# EAGLE schematic ESP32_zigbee_zwave1 (EAGLE 9.6.2)
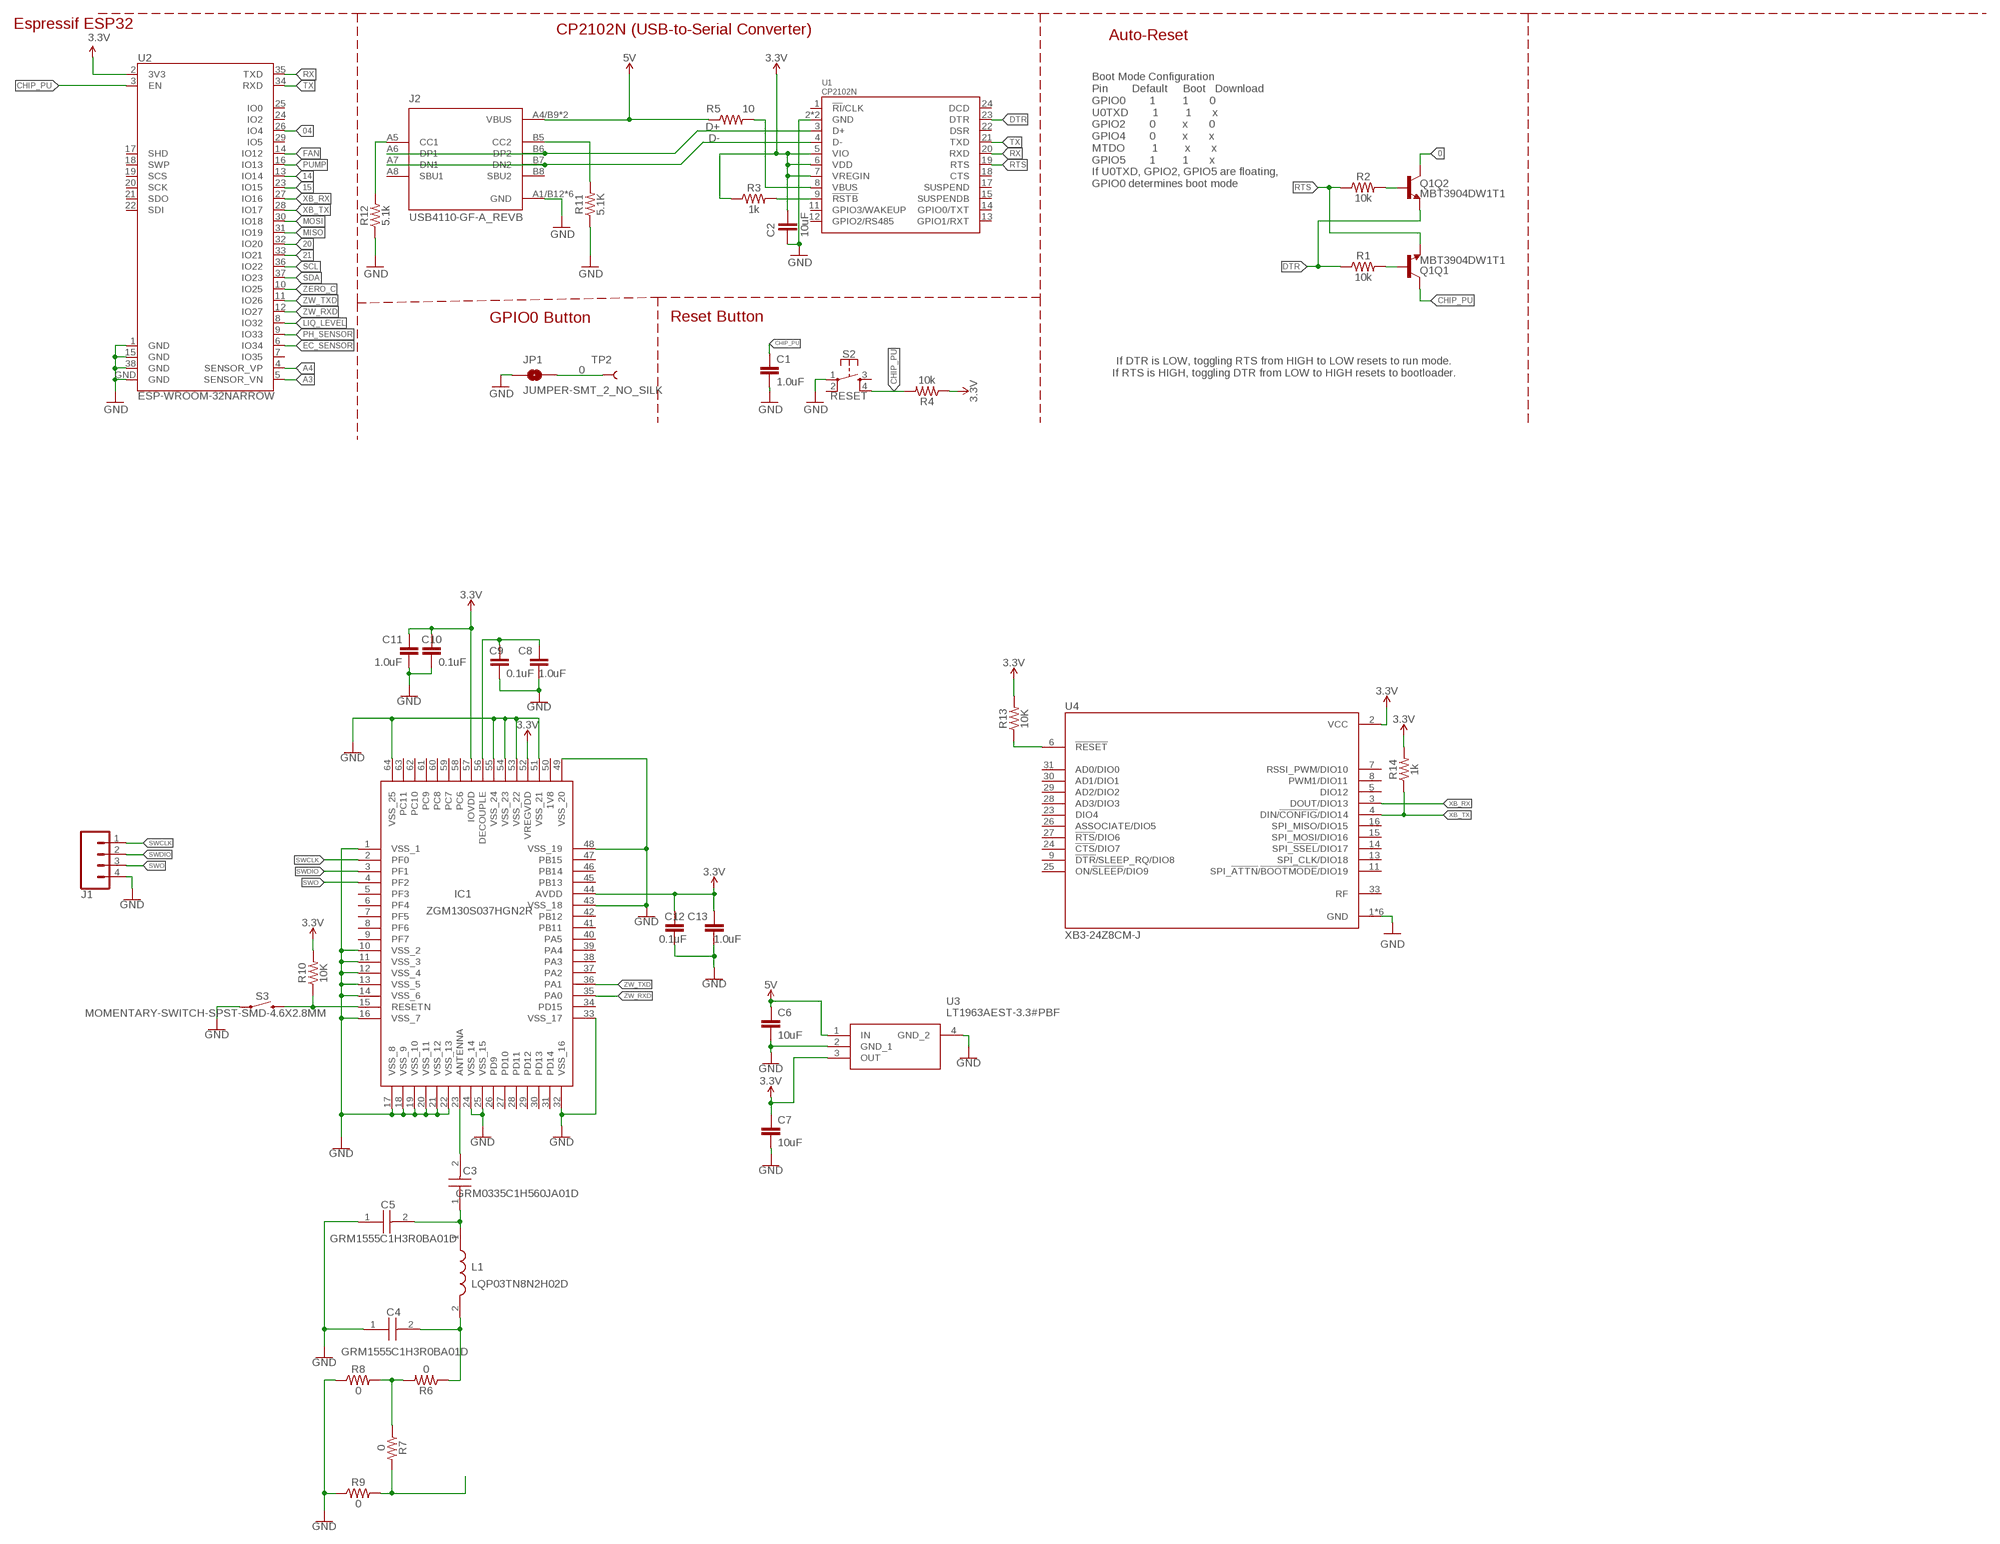
[diagram p0: schematic, sheet 1]

## Parts
C1  1.0uF  1.0UF-0402T-16V-10%  [0402-TIGHT]
C2  10uF  10UF-0402T-6.3V-20%  [0402-TIGHT]
C3  GRM0335C1H560JA01D  [CAPC0603X33N]
C4  GRM1555C1H3R0BA01D  [CAPC1005X55N]
C5  GRM1555C1H3R0BA01D  [CAPC1005X55N]
C6  10uF  10UF-0402T-6.3V-20%  [0402-TIGHT]
C7  10uF  10UF-0402T-6.3V-20%  [0402-TIGHT]
C8  1.0uF  1.0UF-0402T-16V-10%  [0402-TIGHT]
C9  0.1uF  0.1UF-0402T-6.3V-10%-X7R  [0402-TIGHT]
C10  0.1uF  0.1UF-0402T-6.3V-10%-X7R  [0402-TIGHT]
C11  1.0uF  1.0UF-0402T-16V-10%  [0402-TIGHT]
C12  0.1uF  0.1UF-0402T-6.3V-10%-X7R  [0402-TIGHT]
C13  1.0uF  1.0UF-0402T-16V-10%  [0402-TIGHT]
IC1  ZGM130S037HGN2R  [ZGM130S037HGN2R]
J1  CONN_041X04_NO_SILK  [1X04_NO_SILK]
J2  USB4110-GF-A_REVB  [GCT_USB4110-GF-A_REVB]
JP1  JUMPER-SMT_2_NO_SILK  [SMT-JUMPER_2_NO_SILK]
L1  LQP03TN8N2H02D  [LQP03TG3N1B02D]
Q1  MBT3904DW1T1  TRANS_NPN_DUAL-MBT3904DW1T1  [SC70-6]
R1  10k  10KOHM-0402T-1/16W-1%  [0402-TIGHT]
R2  10k  10KOHM-0402T-1/16W-1%  [0402-TIGHT]
R3  1k  1KOHM-0402T-1/16W-1%  [0402-TIGHT]
R4  10k  10KOHM-0402T-1/16W-1%  [0402-TIGHT]
R5  10  10OHM-0603-1/10W-1%  [0603]
R6  0  0OHM-0402T-1/10W  [0402-TIGHT]
R7  0  0OHM-0402T-1/10W  [0402-TIGHT]
R8  0  0OHM-0402T-1/10W  [0402-TIGHT]
R9  0  0OHM-0402T-1/10W  [0402-TIGHT]
R10  10K  10KOHM-0402-1/10W-0.1%  [0402-TIGHT]
R11  5.1K  RESISTOR0402T  [0402-TIGHT]
R12  5.1k  RESISTOR0402T  [0402-TIGHT]
R13  10K  10KOHM-0402-1/10W-0.1%  [0402-TIGHT]
R14  1k  1KOHM-0402T-1/16W-1%  [0402-TIGHT]
S2  RESET  MOMENTARY-SWITCH-SPST-2-SMD-4.6X2.8MM  [TACTILE_SWITCH_SMD_4.6X2.8MM]
S3  MOMENTARY-SWITCH-SPST-SMD-4.6X2.8MM  [TACTILE_SWITCH_SMD_4.6X2.8MM]
TP2  TEST-POINTTP_15TH_THRU  [TP_15TH]
U1  CP2102N  [QFN24]
U2  ESP-WROOM-32NARROW  [ESP-WROOM-32-NARROW]
U3  LT1963AEST-3.3#PBF  [SOT230P700X180-4N]
U4  XB3-24Z8CM-J  [XCVR_XB3-24Z8CM-J]

## Nets
0: JP1.2 Q1.6(Q2:C) TP2.P$1
3.3V: C2.1 C7.1 C10.1 C11.2 C12.1 C13.2 IC1.44(AVDD) IC1.52(VREGVDD) IC1.57(IOVDD) R3.1 R4.1 R10.2 R13.2 R14.2 U1.5(VIO) U1.6(VDD) U1.7(VREGIN) U2.2(3V3) U3.3(OUT) U4.2(VCC)
04: U2.26(IO4)
5V: C6.1 J2.A4/B9(VBUS) J2.B4/A9(VBUS) R5.1 U3.1(IN)
14: U2.13(IO14)
15: U2.23(IO15)
20: U2.32(IO20)
21: U2.33(IO21)
A3: U2.5(SENSOR_VN)
A4: U2.4(SENSOR_VP)
CHIP_PU: C1.1 Q1.3(Q1:C) R4.2 S2.4 U2.3(EN)
D+: J2.A6(DP1) J2.B6(DP2) U1.3(D+)
D-: J2.A7(DN1) J2.B7(DN2) U1.4(D-)
DTR: Q1.1(Q2:E) R1.1 U1.23(DTR)
EC_SENSOR: U2.6(IO34)
FAN: U2.14(IO12)
GND: C1.2 C2.2 C4.1 C5.1 C6.2 C7.2 C8.1 C9.2 C10.2 C11.1 C12.2 C13.1 IC1.1(VSS_1) IC1.10(VSS_2) IC1.11(VSS_3) IC1.12(VSS_4) IC1.13(VSS_5) IC1.14(VSS_6) IC1.16(VSS_7) IC1.17(VSS_8) IC1.18(VSS_9) IC1.19(VSS_10) IC1.20(VSS_11) IC1.21(VSS_12) IC1.22(VSS_13) IC1.24(VSS_14) IC1.25(VSS_15) IC1.32(VSS_16) IC1.33(VSS_17) IC1.43(VSS_18) IC1.48(VSS_19) IC1.49(VSS_20) IC1.51(VSS_21) IC1.53(VSS_22) IC1.54(VSS_23) IC1.55(VSS_24) IC1.64(VSS_25) J1.4 J2.A1/B12(GND) J2.B1/A12(GND) J2.S1(GND) J2.S2(GND) J2.S3(GND) J2.S4(GND) JP1.1 R8.1 R9.1 R11.1 R12.1 S2.1 S3.1 S3.2 U1.2(GND) U1.PAD(GND) U2.1(GND) U2.15(GND) U2.38(GND) U2.GND U3.2(GND_1) U3.4(GND_2) U4.1(GND) U4.10(GND) U4.12(GND) U4.21(GND) U4.32(GND) U4.34(GND)
LIQ_LEVEL: U2.8(IO32)
MISO: U2.31(IO19)
MOSI: U2.30(IO18)
N$1: Q1.5(Q1:B) R1.2
N$2: Q1.2(Q2:B) R2.2
N$3: R3.2 U1.9(!RSTB)
N$4: R5.2 U1.8(VBUS)
N$5: C3.2 IC1.23(ANTENNA)
N$6: C3.1 C5.2 L1.1
N$7: C4.2 L1.2 R6.1
N$8: R6.2 R7.1 R8.2
N$9: R7.2 R9.2
N$10: IC1.15(RESETN) R10.1 S3.3 S3.4
N$11: J2.B5(CC2) R11.2
N$12: J2.A5(CC1) R12.2
N$13: R13.1 U4.6(!RESET)
N$14: C8.2 C9.1 IC1.56(DECOUPLE)
PH_SENSOR: U2.9(IO33)
PUMP: U2.16(IO13)
RTS: Q1.4(Q1:E) R2.1 U1.19(RTS)
RX: U1.20(RXD) U2.35(TXD)
SCL: U2.36(IO22)
SDA: U2.37(IO23)
SWCLK: IC1.2(PF0) J1.1
SWDIO: IC1.3(PF1) J1.2
SWO: IC1.4(PF2) J1.3
TX: U1.21(TXD) U2.34(RXD)
XB_RX: U2.27(IO16) U4.3(DOUT/DIO13)
XB_TX: R14.1 U2.28(IO17) U4.4(DIN/!CONFIG!/DIO14)
ZERO_C: U2.10(IO25)
ZW_RXD: IC1.35(PA0) U2.12(IO27)
ZW_TXD: IC1.36(PA1) U2.11(IO26)
Unconnected: IC1.5(PF3) IC1.6(PF4) IC1.7(PF5) IC1.8(PF6) IC1.9(PF7) IC1.26(PD9) IC1.27(PD10) IC1.28(PD11) IC1.29(PD12) IC1.30(PD13) IC1.31(PD14) IC1.34(PD15) IC1.37(PA2) IC1.38(PA3) IC1.39(PA4) IC1.40(PA5) IC1.41(PB11) IC1.42(PB12) IC1.45(PB13) IC1.46(PB14) IC1.47(PB15) IC1.50(1V8) IC1.58(PC6) IC1.59(PC7) IC1.60(PC8) IC1.61(PC9) IC1.62(PC10) IC1.63(PC11) J2.A8(SBU1) J2.B8(SBU2) S2.2 S2.3 U1.1(!RI!/CLK) U1.11(GPIO3/WAKEUP) U1.12(GPIO2/RS485) U1.13(GPIO1/RXT) U1.14(GPIO0/TXT) U1.15(SUSPENDB) U1.17(SUSPEND) U1.18(CTS) U1.22(DSR) U1.24(DCD) U2.7(IO35) U2.17(SHD) U2.18(SWP) U2.19(SCS) U2.20(SCK) U2.21(SDO) U2.22(SDI) U2.24(IO2) U2.25(IO0) U2.29(IO5) U4.5(DIO12) U4.7(RSSI_PWM/DIO10) U4.8(PWM1/DIO11) U4.9(!DTR!/SLEEP_RQ/DIO8) U4.11(SPI_!ATTN!/!BOOTMODE!/DIO19) U4.13(SPI_CLK/DIO18) U4.14(SPI_!SSEL!/DIO17) U4.15(SPI_MOSI/DIO16) U4.16(SPI_MISO/DIO15) U4.23(DIO4) U4.24(!CTS!/DIO7) U4.25(ON/!SLEEP!/DIO9) U4.26(ASSOCIATE/DIO5) U4.27(!RTS!/DIO6) U4.28(AD3/DIO3) U4.29(AD2/DIO2) U4.30(AD1/DIO1) U4.31(AD0/DIO0) U4.33(RF)

## Notes on the sheet
- Espressif ESP32
- CP2102N (USB-to-Serial Converter)
- Auto-Reset
- Boot Mode Configuration
  Pin        Default     Boot   Download
  GPIO0        1         1       0
  U0TXD        1         1       x
  GPIO2        0         x       0
  GPIO4        0         x       x
  MTDO         1         x       x
  GPIO5        1         1       x
  If U0TXD, GPIO2, GPIO5 are floating, 
  GPIO0 determines boot mode
- GPIO0 Button | Reset Button
- If DTR is LOW, toggling RTS from HIGH to LOW resets to run mode.
  If RTS is HIGH, toggling DTR from LOW to HIGH resets to bootloader.

## Library data of the parts
C1 C8 C11 C13 = SparkFun-Capacitors:1.0UF: 1µF ceramic capacitors A capacitor is a passive two-terminal electrical component used to store electrical energy temporarily in an electric field.; PROD_ID: CAP-12417
C2 C6 C7 = SparkFun-Capacitors:10UF: 10.0µF ceramic capacitors A capacitor is a passive two-terminal electrical component used to store electrical energy temporarily in an electric field.; PROD_ID: CAP-14848
C3 = GRM0335C1H560JA01D:GRM0335C1H560JA01D: Murata 0201 GRM 56pF Ceramic Multilayer Capacitor, 50 V, +125C, C0G Dielectric, +/-5% SMD Source: Datasheet <https://psearch.en.murata.com/capacitor/product/GRM0335C1H560JA01#.html>; ARROW_PART_NUMBER: GRM0335C1H560JA01D; ARROW_PRICE-STOCK: https://www.arrow.com/en/products/grm0335c1h560ja01d/murata-manufacturing; DESCRIPTION: Murata 0201 GRM 56pF Ceramic Multilayer Capacitor, 50 V, +125C, C0G Dielectric, +/-5% SMD; HEIGHT: 0.33mm; MANUFACTURER_NAME: Murata Electronics; MANUFACTURER_PART_NUMBER: GRM0335C1H560JA01D; MOUSER_PART_NUMBER: 81-GRM0335C1H560JA1D; MOUSER_PRICE-STOCK: https://www.mouser.com/Search/Refine.aspx?Keyword=81-GRM0335C1H560JA1D
C4 C5 = GRM1555C1H3R0BA01D:GRM1555C1H3R0BA01D: Capacitor MLCC GRM 0402 3pF 50V C0G Murata 0402 GRM 3pF Ceramic Multilayer Capacitor, 50 V dc, +125C, C0G Dielectric, +/-0.1pF SMD Source: Datasheet <https://datasheet.datasheetarchive.com/originals/distributors/Datasheets_SAMA/ec4f1577dddcc7a13ddad897a28002d3.pdf>; ARROW_PART_NUMBER: GRM1555C1H3R0BA01D; ARROW_PRICE-STOCK: https://www.arrow.com/en/products/grm1555c1h3r0ba01d/murata-manufacturing?region=nac; DESCRIPTION: Capacitor MLCC GRM 0402 3pF 50V C0G Murata 0402 GRM 3pF Ceramic Multilayer Capacitor, 50 V dc, +125C, C0G Dielectric, +/-0.1pF SMD; HEIGHT: 0.55mm; MANUFACTURER_NAME: Murata Electronics; MANUFACTURER_PART_NUMBER: GRM1555C1H3R0BA01D; MOUSER_PART_NUMBER: 81-GRM1555C1H3R0BA1D; MOUSER_PRICE-STOCK: https://www.mouser.co.uk/ProductDetail/Murata-Electronics/GRM1555C1H3R0BA01D?qs=ouTquLLW2S5g5Yak4wnjeg%3D%3D
C9 C10 C12 = SparkFun-Capacitors:0.1UF: 0.1µF ceramic capacitors A capacitor is a passive two-terminal electrical component used to store electrical energy temporarily in an electric field.; PROD_ID: CAP-14993
IC1 = ZGM130S037HGN2R:ZGM130S037HGN2R: Z-Wave Module 64-Pin LGA T/R Source: Datasheet <https://www.silabs.com/documents/public/data-sheets/zgm130s-datasheet.pdf>; ARROW_PART_NUMBER: ZGM130S037HGN2R; ARROW_PRICE-STOCK: https://www.arrow.com/en/products/zgm130s037hgn2r/silicon-labs; DESCRIPTION: Z-Wave Module 64-Pin LGA T/R; HEIGHT: 1.3mm; MANUFACTURER_NAME: Silicon Labs; MANUFACTURER_PART_NUMBER: ZGM130S037HGN2R; MOUSER_PART_NUMBER: 634-ZGM130S037HGN2R; MOUSER_PRICE-STOCK: https://www.mouser.co.uk/ProductDetail/Silicon-Labs/ZGM130S037HGN2R?qs=OTrKUuiFdkYipTRfJ5tk3g%3D%3D
J1 = SparkFun-Connectors:CONN_04: Multi connection point. Often used as Generic Header-pin footprint for 0.1 inch spaced/style header connections On any of the 0.1 inch spaced packages, you can populate with these: Break Away Headers - Straight <https://www.sparkfun.com/products/116> (PRT-00116) Break Away Male Headers - Right Angle <https://www.sparkfun.com/products/553> (PRT-00553) Female Headers <https://www.sparkfun.com/products/115> (PRT-00115) Break Away Headers - Machine Pin <https://www.sparkfun.com/products/117> (PRT-00117) Break Away Female Headers - Swiss Machine Pin <https://www.sparkfun.com/products/743> (PRT-00743) For SCREWTERMINALS and SPRING TERMINALS visit here: Screw Terimnals on SparkFun.com <https://www.sparkfun.com/search/results?term=Screw+Terminals> (5mm/3.5mm/2.54mm spacing) This device is also useful as a general connection point to wire up your design to another part of your project. Our various solder wires solder well into these plated through hole pads. Hook-Up Wire - Assortment (Stranded, 22 AWG) <https://www.sparkfun.com/products/11375> (PRT-11375) Hook-Up Wire - Assortment (Solid Core, 22 AWG) <https://www.sparkfun.com/products/11367> (PRT-11367) View the entire wire category on our website here <https://www.sparkfun.com/categories/141> Special notes: Molex polarized connector foot print use with SKU : PRT-08231 with associated crimp pins and housings. 1MM SMD Version SKU: PRT-10208; PROD_ID: CONN-09696
J2 = USB4110-GF-A_REVB:USB4110-GF-A_REVB: Check availability <https://pricing.snapeda.com/parts/USB4110-GF-A/GCT/view-part?ref=eda>; AVAILABILITY: In Stock; DESCRIPTION: USB-C (USB TYPE-C) USB 2.0 Receptacle Connector 24 (16+8 Dummy) Position Surface Mount, Right Angle; Through Hole; MF: GCT; MP: USB4110-GF-A; PACKAGE: None; PRICE: None; PURCHASE-URL: https://pricing.snapeda.com/search/part/USB4110-GF-A/?ref=eda
JP1 = SparkFun-Jumpers:JUMPER-SMT_2_NO: Normally open jumper This jumper has two pads in close proximity to each other. Apply solder to close the connection. Round pads are easier to solder for beginners, but are a lot larger. SparkFun Product that uses the round pads: SparkFun EL Sequencer <https://www.sparkfun.com/products/12781>
L1 = LQP03TN8N2H02D:LQP03TN8N2H02D: Murata LQP Series Shielded Wire-wound SMD Inductor with a Non-Magnetic Core Core, 8.2 nH +/-3% 250mA Idc Q:14 Source: Datasheet <https://psearch.en.murata.com/inductor/product/LQP03TN8N2H02#.html>; ARROW_PART_NUMBER: LQP03TN8N2H02D; ARROW_PRICE-STOCK: https://www.arrow.com/en/products/lqp03tn8n2h02d/murata-manufacturing; DESCRIPTION: Murata LQP Series Shielded Wire-wound SMD Inductor with a Non-Magnetic Core Core, 8.2 nH +/-3% 250mA Idc Q:14; HEIGHT: 0.33mm; MANUFACTURER_NAME: Murata Electronics; MANUFACTURER_PART_NUMBER: LQP03TN8N2H02D; MOUSER_PART_NUMBER: 81-LQP03TN8N2H02D; MOUSER_PRICE-STOCK: https://www.mouser.co.uk/ProductDetail/Murata-Electronics/LQP03TN8N2H02D?qs=e%252BE4OD6MgMeYCCZ2V7FxZw%3D%3D
Q1 = SparkFun-DiscreteSemi:TRANS_NPN_DUAL: Dual NPN Transistors in Single Package The MBT3904W1 puts two general purpose 3904 NPN transistors in a single package. Datasheet <http://www.onsemi.com/pub_link/Collateral/MBT3904DW1T1-D.PDF> SparkFun Products: SparkFun ESP32 Thing <https://www.sparkfun.com/products/13907>; PROD_ID: TRANS-13337
R1 R2 R4 = SparkFun-Resistors:10KOHM: 10kΩ resistor A resistor is a passive two-terminal electrical component that implements electrical resistance as a circuit element. Resistors act to reduce current flow, and, at the same time, act to lower voltage levels within circuits. - Wikipedia; PROD_ID: RES-14241
R3 R14 = SparkFun-Resistors:1KOHM: 1kΩ resistor A resistor is a passive two-terminal electrical component that implements electrical resistance as a circuit element. Resistors act to reduce current flow, and, at the same time, act to lower voltage levels within circuits. - Wikipedia; PROD_ID: RES-14342
R5 = SparkFun-Resistors:10OHM: 10Ω resistor A resistor is a passive two-terminal electrical component that implements electrical resistance as a circuit element. Resistors act to reduce current flow, and, at the same time, act to lower voltage levels within circuits. - Wikipedia; PROD_ID: RES-12581
R6-R9 = SparkFun-Resistors:0OHM: 0Ω resistor A resistor is a passive two-terminal electrical component that implements electrical resistance as a circuit element. Resistors act to reduce current flow, and, at the same time, act to lower voltage levels within circuits. - Wikipedia; PROD_ID: RES-14244
R10 R13 = SparkFun-Resistors:10KOHM: 10kΩ resistor A resistor is a passive two-terminal electrical component that implements electrical resistance as a circuit element. Resistors act to reduce current flow, and, at the same time, act to lower voltage levels within circuits. - Wikipedia; PROD_ID: RES-16147
R11 R12 = SparkFun-Resistors:RESISTOR: Generic Resistor Package
S2 = SparkFun-Switches:MOMENTARY-SWITCH-SPST-2: Momentary Switch (Pushbutton) - SPST - Two Circuits Normally-open (NO) SPST momentary switches (buttons, pushbuttons). Schematic symbol includes two switch circuits. Variants SMD-4.6MMX2.8MM - 4.60mm x 2.80mm Tactile Momentary Button Switch - Used on SparkFun SAMD21 Mini Breakout <https://www.sparkfun.com/products/13664> SMD-5.2MM - Mini Pushbutton Switch - SMD <https://www.sparkfun.com/products/8720> - Used on Arduino Pro Mini <https://www.sparkfun.com/products/11114>; PROD_ID: SWCH-13065
S3 = SparkFun-Switches:MOMENTARY-SWITCH-SPST: Momentary Switch (Pushbutton) - SPST Normally-open (NO) SPST momentary switches (buttons, pushbuttons). Variants PTH-12MM - 12mm square, through-hole Momentary Pushbutton Switch - 12mm Square <https://www.sparkfun.com/products/9190> (COM-09190) PTH-6.0MM, PTH-6.0MM-KIT - 6.0mm square, through-hole Mini Pushbutton Switch <https://www.sparkfun.com/products/97> (COM-00097) KIT package intended for soldering kit's - only one side of pads' copper is exposed. PTH-RIGHT-ANGLE-KIT - Right-angle, through-hole Right Angle Tactile Button <https://www.sparkfun.com/products/10791> - Used on SparkFun BigTime Watch Kit <https://www.sparkfun.com/products/11734> SMD-12MM - 12mm square, surface-mount Tactile Button - SMD (12mm) <https://www.sparkfun.com/products/12993> (COM-12993) Used on SparkFun PicoBoard <https://www.sparkfun.com/products/11888> SMD-4.5MM - 4.5mm Square Trackball Switch Used on SparkFun Blackberry Trackballer Breakout <https://www.sparkfun.com/products/13169> SMD-4.6MMX2.8MM - 4.60mm x 2.80mm, surface mount Used on SparkFun Pro Micro - RP2040 <https://www.sparkfun.com/products/17717> SMD-5.2MM, SMD-5.2-REDUNDANT - 5.2mm square, surface-mount Mini Pushbutton Switch - SMD <https://www.sparkfun.com/products/8720> (COM-08720) Used on Arduino Pro Mini <https://www.sparkfun.com/products/11114> REDUNDANT package connects both switch circuits together SMD-6.0X3.5MM - 6.0 x 3.5mm, surface mount Momentary Reset Switch SMD <https://www.sparkfun.com/products/8229> (COM-08229) SMD-6.2MM-TALL - 6.2mm square, surface mount Tactile Button - SMD (6mm) <https://www.sparkfun.com/products/12992> Used on SparkFun Digital Sandbox <https://www.sparkfun.com/products/12651> SMD-RIGHT-ANGLE - Right-angle, surface mount Used on SparkFun Block for Intel® Edison - Arduino <https://www.sparkfun.com/products/13036>; PROD_ID: SWCH-15606
TP2 = SparkFun-Connectors:TEST-POINT: SparkFun Test Points Bare copper test points for troubleshooting or In-Circuit-Testing. These are used by our Production team for verifying production board runs using pogo-pins on test beds. SparkFun Products: SparkFun LSM9DS1 Breakout <https://www.sparkfun.com/products/13284> SparkFun PSOC <https://www.sparkfun.com/products/13714> SparkFun Load Cell Amplifier <https://www.sparkfun.com/products/13879>
U1 = SparkFun-IC-Comms:CP2102N; PROD_ID: IC-14020
U2 = SparkFun-RF:ESP-WROOM-32; PROD_ID: IC-13849
U3 = LT1963AEST-3.3#PBF:LT1963AEST-3.3#PBF: LDO Regulator 3.3V 1.5A Low Noise SOT223 Linear Technology LT1963AEST-3.3#PBF, LDO Voltage Regulator, 1.5A, 3.3 V, -20 20 Vin, 4-Pin SOT-223 Source: Datasheet <http://www.farnell.com/datasheets/1761433.pdf>; ARROW_PART_NUMBER: LT1963AEST-3.3#PBF; ARROW_PRICE-STOCK: https://www.arrow.com/en/products/lt1963aest-3.3pbf/linear-technology; DESCRIPTION: LDO Regulator 3.3V 1.5A Low Noise SOT223 Linear Technology LT1963AEST-3.3#PBF, LDO Voltage Regulator, 1.5A, 3.3 V, -20 20 Vin, 4-Pin SOT-223; HEIGHT: 1.8mm; MANUFACTURER_NAME: Analog Devices; MANUFACTURER_PART_NUMBER: LT1963AEST-3.3#PBF; MOUSER_PART_NUMBER: 584-1963AEST-3.3PBF; MOUSER_PRICE-STOCK: https://www.mouser.co.uk/ProductDetail/Analog-Devices/LT1963AEST-3.3PBF?qs=ytflclh7QUWACCdXyVJ5gA%3D%3D
U4 = XB3-24Z8CM-J:XB3-24Z8CM-J: XBee3, 2.4 GHz ZB 3.0, Chip Ant, MMT Check availability <https://pricing.snapeda.com/parts/XB3-24Z8CM-J/Digi%20International/view-part?ref=eda>; AVAILABILITY: In Stock; DESCRIPTION: 802.15.4 Zigbee® Transceiver Module 2.4GHz Integrated, Chip Surface Mount; MF: Digi International; MP: XB3-24Z8CM-J; PACKAGE: SMD-34 Digi International; PRICE: None; PURCHASE-URL: https://pricing.snapeda.com/search/part/XB3-24Z8CM-J/?ref=eda